# EAGLE schematic kegboard-mini (EAGLE 5.11)
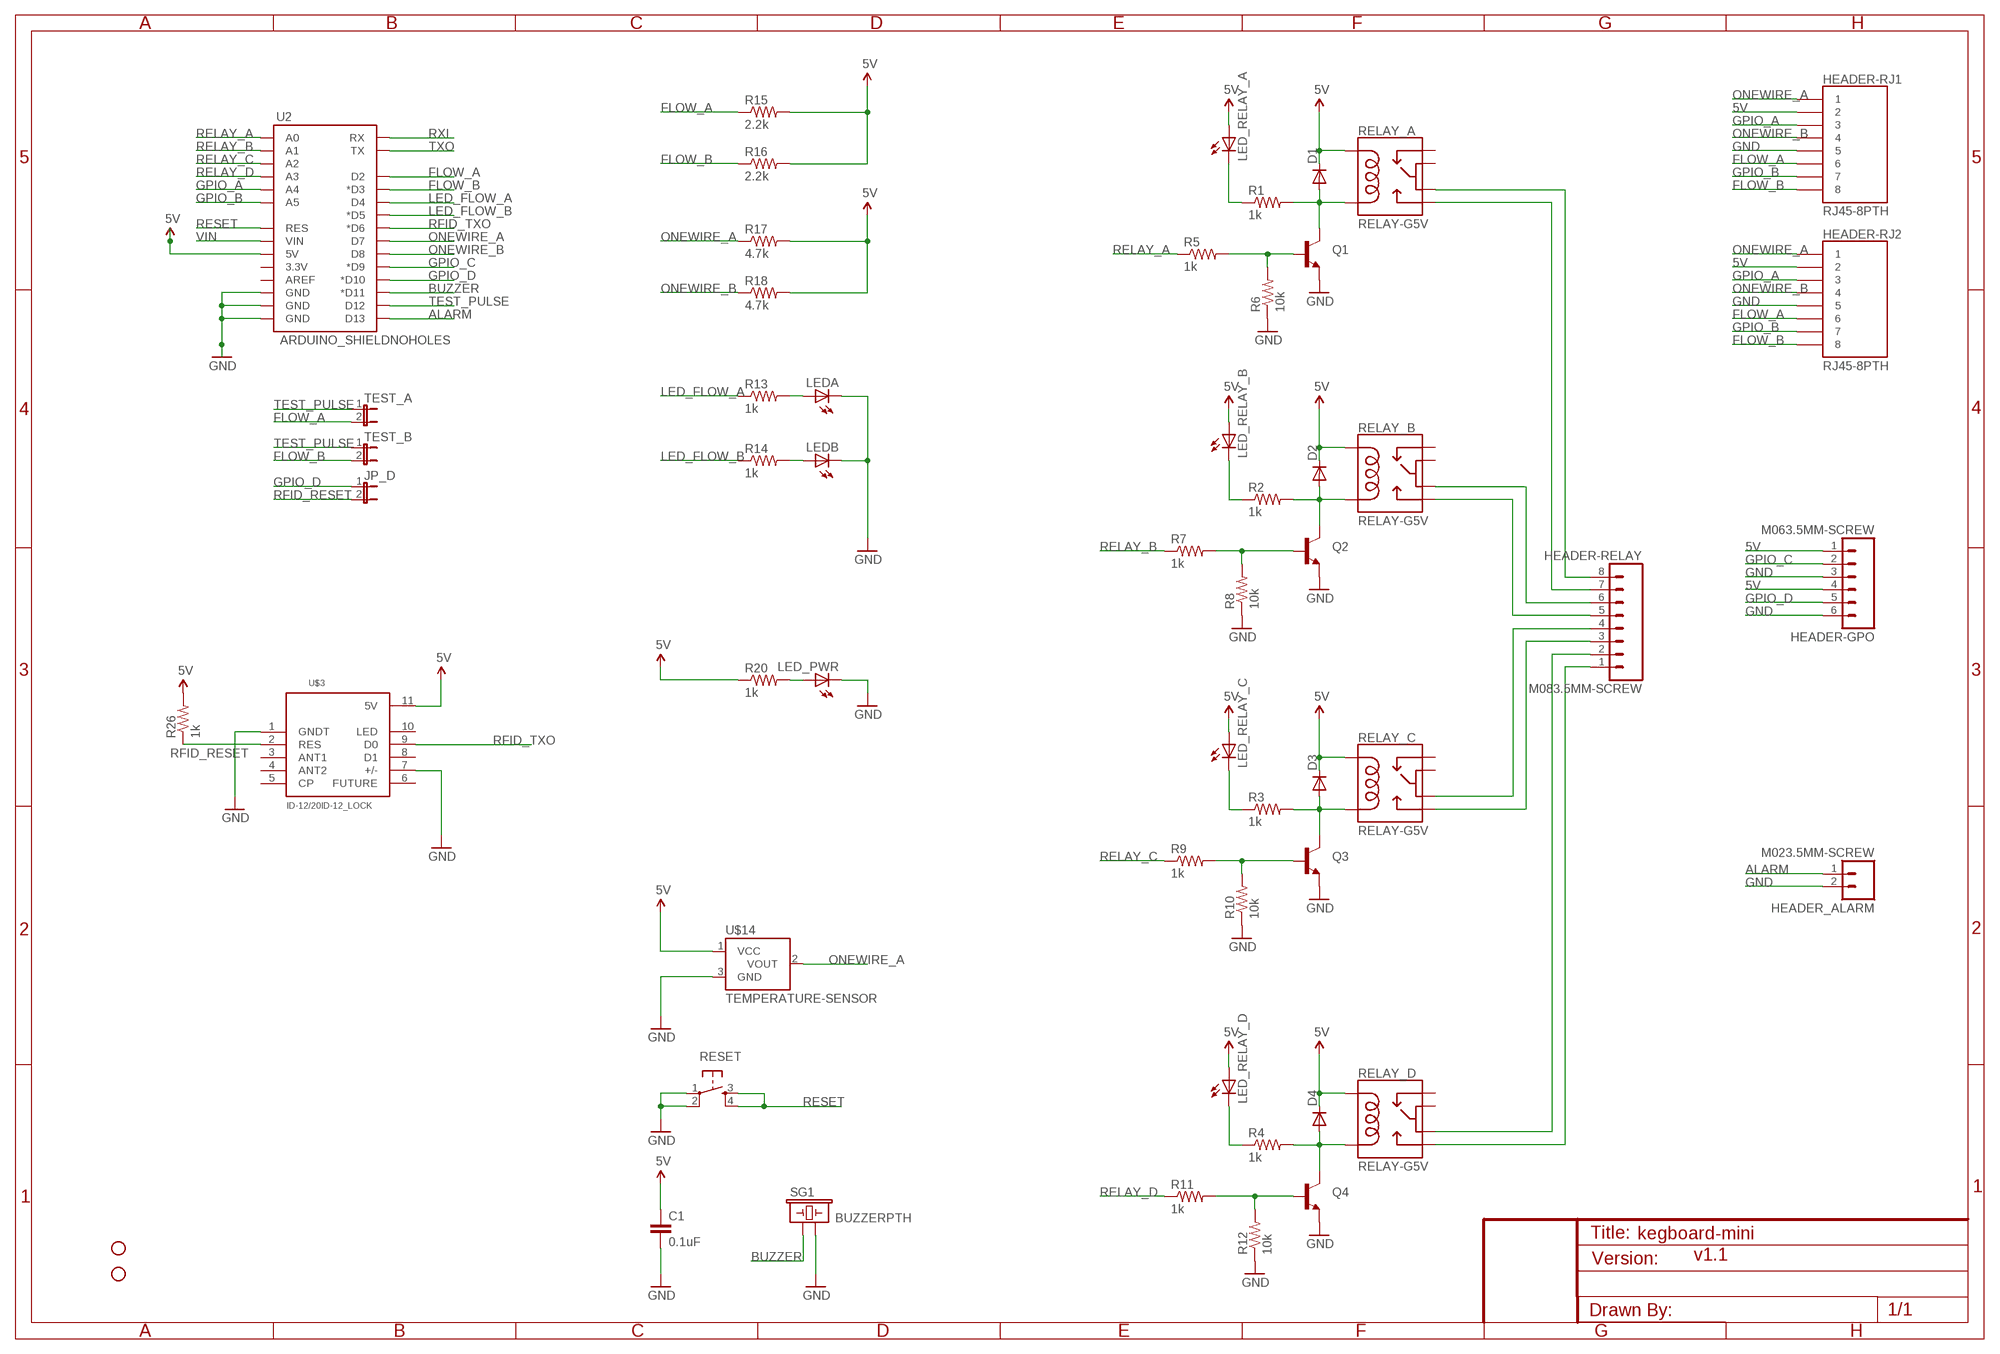
[diagram p0: schematic, sheet 1]

## Parts
C1  0.1uF  CAPPTH  [CAP-PTH-SMALL]
D1  DIODE1N4148  [DIODE-1N4148]
D2  DIODE1N4148  [DIODE-1N4148]
D3  DIODE1N4148  [DIODE-1N4148]
D4  DIODE1N4148  [DIODE-1N4148]
HEADER-GPO  M063.5MM-SCREW  M063.5MM-6  [SCREWTERMINAL-3.5MM-6]
HEADER-RELAY  M083.5MM-SCREW  M083.5MM-8  [SCREWTERMINAL-3.5MM-8]
HEADER-RJ1  RJ45-8PTH  [RJ45-8]
HEADER-RJ2  RJ45-8PTH  [RJ45-8]
HEADER_ALARM  M023.5MM-SCREW  M023.5MM  [SCREWTERMINAL-3.5MM-2]
JP3  STAND-OFF  [STAND-OFF]
JP5  STAND-OFF  [STAND-OFF]
JP_D  JUMPER-2PTH  [1X02]
LED_PWR  LED3MM  [LED3MM]
LED_RELAY_A  LED3MM  [LED3MM]
LED_RELAY_B  LED3MM  [LED3MM]
LED_RELAY_C  LED3MM  [LED3MM]
LED_RELAY_D  LED3MM  [LED3MM]
LEDA  LED3MM  [LED3MM]
LEDB  LED3MM  [LED3MM]
Q1  TRANSISTOR_NPNTO92  [TO-92]
Q2  TRANSISTOR_NPNTO92  [TO-92]
Q3  TRANSISTOR_NPNTO92  [TO-92]
Q4  TRANSISTOR_NPNTO92  [TO-92]
R1  1k  RESISTORPTH1  [AXIAL-0.3]
R2  1k  RESISTORPTH1  [AXIAL-0.3]
R3  1k  RESISTORPTH1  [AXIAL-0.3]
R4  1k  RESISTORPTH1  [AXIAL-0.3]
R5  1k  RESISTORPTH1  [AXIAL-0.3]
R6  10k  RESISTORPTH1  [AXIAL-0.3]
R7  1k  RESISTORPTH1  [AXIAL-0.3]
R8  10k  RESISTORPTH1  [AXIAL-0.3]
R9  1k  RESISTORPTH1  [AXIAL-0.3]
R10  10k  RESISTORPTH1  [AXIAL-0.3]
R11  1k  RESISTORPTH1  [AXIAL-0.3]
R12  10k  RESISTORPTH1  [AXIAL-0.3]
R13  1k  RESISTORPTH1  [AXIAL-0.3]
R14  1k  RESISTORPTH1  [AXIAL-0.3]
R15  2.2k  RESISTORPTH1  [AXIAL-0.3]
R16  2.2k  RESISTORPTH1  [AXIAL-0.3]
R17  4.7k  RESISTORPTH1  [AXIAL-0.3]
R18  4.7k  RESISTORPTH1  [AXIAL-0.3]
R20  1k  RESISTORPTH1  [AXIAL-0.3]
R26  1k  RESISTORPTH1  [AXIAL-0.3]
RELAY_A  RELAY-G5V  RELAY-2G5Q  [RELAY-G5V]
RELAY_B  RELAY-G5V  RELAY-2G5Q  [RELAY-G5V]
RELAY_C  RELAY-G5V  RELAY-2G5Q  [RELAY-G5V]
RELAY_D  RELAY-G5V  RELAY-2G5Q  [RELAY-G5V]
RESET  TAC_SWITCHPTH  [TACTILE-PTH]
SG1  BUZZERPTH  [BUZZER-12MM]
TEST_A  JUMPER-2PTH  [1X02]
TEST_B  JUMPER-2PTH  [1X02]
U2  ARDUINO_SHIELDNOHOLES  [DUEMILANOVE_SHIELD_NOHOLES]
U$3  ID-12/20ID-12_LOCK  [ID-12_LOCK]
U$14  TEMPERATURE-SENSOR  [TO-92]

## Nets
5V: C1.1 D1.C D2.C D3.C D4.C HEADER-GPO.1 HEADER-GPO.4 HEADER-RJ1.2 HEADER-RJ2.2 LED_RELAY_A.A LED_RELAY_B.A LED_RELAY_C.A LED_RELAY_D.A R15.P$2 R16.P$2 R17.P$2 R18.P$2 R20.P$1 R26.P$2 RELAY_A.2 RELAY_B.2 RELAY_C.2 RELAY_D.2 U2.5V U$3.11(5V) U$14.1(VCC)
ALARM: HEADER_ALARM.1 U2.D13
BUZZER: SG1.+ U2.D11(*D11)
FLOW_A: HEADER-RJ1.6 HEADER-RJ2.6 R15.P$1 TEST_A.2 U2.D2
FLOW_B: HEADER-RJ1.8 HEADER-RJ2.8 R16.P$1 TEST_B.2 U2.D3(*D3)
GND: C1.2 HEADER-GPO.3 HEADER-GPO.6 HEADER-RJ1.5 HEADER-RJ2.5 HEADER_ALARM.2 LED_PWR.K(C) LEDA.K(C) LEDB.K(C) Q1.1(E) Q2.1(E) Q3.1(E) Q4.1(E) R6.P$1 R8.P$1 R10.P$1 R12.P$1 RESET.1 RESET.2 SG1.- U2.GND@0(GND) U2.GND@1(GND) U2.GND@2(GND) U$3.1(GNDT) U$3.7(+/-) U$14.3(GND)
GPIO_A: HEADER-RJ1.3 HEADER-RJ2.3 U2.A4
GPIO_B: HEADER-RJ1.7 HEADER-RJ2.7 U2.A5
GPIO_C: HEADER-GPO.2 U2.D9(*D9)
GPIO_D: HEADER-GPO.5 JP_D.1 U2.D10(*D10)
LED_FLOW_A: R13.P$1 U2.D4
LED_FLOW_B: R14.P$1 U2.D5(*D5)
LED_RELAY_D: LED_RELAY_D.K(C) R4.P$1
N$1: LED_RELAY_A.K(C) R1.P$1
N$2: Q2.2(B) R7.P$2 R8.P$2
N$3: Q1.2(B) R5.P$2 R6.P$2
N$4: Q3.2(B) R9.P$2 R10.P$2
N$5: LED_RELAY_C.K(C) R3.P$1
N$6: Q4.2(B) R11.P$2 R12.P$2
N$7: LED_RELAY_B.K(C) R2.P$1
N$8: LEDB.A R14.P$2
N$9: LEDA.A R13.P$2
N$10: D1.A Q1.3(C) R1.P$2 RELAY_A.9
N$12: D2.A Q2.3(C) R2.P$2 RELAY_B.9
N$13: LED_PWR.A R20.P$2
N$14: D3.A Q3.3(C) R3.P$2 RELAY_C.9
N$15: HEADER-RELAY.8 RELAY_A.6
N$16: D4.A Q4.3(C) R4.P$2 RELAY_D.9
N$20: HEADER-RELAY.7 RELAY_A.10
N$21: HEADER-RELAY.6 RELAY_B.6
N$22: HEADER-RELAY.5 RELAY_B.10
N$23: HEADER-RELAY.4 RELAY_C.6
N$25: HEADER-RELAY.3 RELAY_C.10
N$26: HEADER-RELAY.2 RELAY_D.6
N$27: HEADER-RELAY.1 RELAY_D.10
ONEWIRE_A: HEADER-RJ1.1 HEADER-RJ2.1 R17.P$1 U2.D7 U$14.2(VOUT)
ONEWIRE_B: HEADER-RJ1.4 HEADER-RJ2.4 R18.P$1 U2.D8
RELAY_A: R5.P$1 U2.A0
RELAY_B: R7.P$1 U2.A1
RELAY_C: R9.P$1 U2.A2
RELAY_D: R11.P$1 U2.A3
RESET: RESET.3 RESET.4 U2.RES
RFID_RESET: JP_D.2 R26.P$1 U$3.2(RES)
RFID_TXO: U2.D6(*D6) U$3.9(D0)
RXI: U2.RX
TEST_PULSE: TEST_A.1 TEST_B.1 U2.D12
TXO: U2.TX
VIN: U2.VIN
Unconnected: RELAY_A.1 RELAY_A.5 RELAY_B.1 RELAY_B.5 RELAY_C.1 RELAY_C.5 RELAY_D.1 RELAY_D.5 U2.3.3V U2.AREF U$3.3(ANT1) U$3.4(ANT2) U$3.5(CP) U$3.6(FUTURE) U$3.8(D1) U$3.10(LED)

## Notes on the sheet
- v1.1

## Library data of the parts
C1 = SparkFun:CAP: Capacitor Standard 0603 ceramic capacitor, and 0.1" leaded capacitor.
D1-D4 = SparkFun:DIODE: Diode These are standard reverse protection diodes and small signal diodes. SMA package can handle up to about 1A. SOD-323 can handle about 200mA. What the SOD-323 package when ordering, there are some mfgs out there that are 5-pin packages.
HEADER-GPO = SparkFun:M06: Header 6 Standard 6-pin 0.1" header. Use with straight break away headers (SKU : PRT-00116), right angle break away headers (PRT-00553), swiss pins (PRT-00743), machine pins (PRT-00117), and female headers (PRT-00115). Molex polarized connector foot print use with SKU : PRT-08094 with associated crimp pins and housings. NOTES ON THE VARIANTS LOCK and LOCK_LONGPADS... This footprint was designed to help hold the alignment of a through-hole component (i.e. 6-pin header) while soldering it into place. You may notice that each hole has been shifted either up or down by 0.005 of an inch from it's more standard position (which is a perfectly straight line). This slight alteration caused the pins (the squares in the middle) to touch the edges of the holes. Because they are alternating, it causes a "brace" to hold the component in place. 0.005 has proven to be the perfect amount of "off-center" position when using our standard breakaway headers. Although looks a little odd when you look at the bare footprint, once you have a header in there, the alteration is very hard to notice. Also, if you push a header all the way into place, it is covered up entirely on the bottom side. This idea of altering the position of holes to aid alignment will be further integrated into the Sparkfun Library for other footprints. It can help hold any component with 3 or more connection pins.
HEADER-RELAY = SparkFun:M08: Header 8 Standard 8-pin 0.1" header. Use with straight break away headers (SKU : PRT-00116), right angle break away headers (PRT-00553), swiss pins (PRT-00743), machine pins (PRT-00117), and female headers (PRT-00115).
HEADER-RJ1 HEADER-RJ2 = SparkFun:RJ45-8: RJ45 Jack Simple RJ45, 8-pin connection - connector for common Cat5, Cat5e, and Cat6 Ethernet cables. Footprint not yet proven in production. Connector sku is PRT-00643; Breakout PCB sku is BOB-00716.
HEADER_ALARM = SparkFun:M02: Header 2 Standard 2-pin 0.1" header. Use with straight break away headers (SKU : PRT-00116), right angle break away headers (PRT-00553), swiss pins (PRT-00743), machine pins (PRT-00117), and female headers (PRT-00115). Molex polarized connector foot print use with SKU : PRT-08233 with associated crimp pins and housings.
JP3 JP5 = SparkFun:STAND-OFF: Stand Off This is the mechanical footprint for a #4 phillips button head screw. Use the keepout ring to avoid running the screw head into surrounding components. SKU : PRT-00447
JP_D TEST_A TEST_B = SparkFun-20100412:JUMPER-2: Jumper Basic 0.1" spaced jumper. Use with breakaway headers.
LED_PWR LED_RELAY_A LED_RELAY_B LED_RELAY_C LED_RELAY_D LEDA LEDB = SparkFun:LED: LEDs Standard schematic elements and footprints for 5mm, 3mm, 1206, and 0603 sized LEDs. 5mm - Spark Fun Electronics SKU : COM-00529 (and others)
Q1-Q4 = SparkFun:TRANSISTOR_NPN: Transistor NPN BJT configuration in SOT23 package. MMBT2222 is the common NPN we use. Double check BCE configuration again layout.
R1-R18 R20 R26 = SparkFun:RESISTOR: Resistor Basic schematic elements and footprints for 0603, 1206, and PTH 1/10th watt (small) resistors.
RELAY_A RELAY_B RELAY_C RELAY_D = SparkFun:RELAY-2
RESET = SparkFun:TAC_SWITCH: Momentary Switch Button commonly used for reset or general input. Spark Fun Electronics SKU : COM-00097
SG1 = SparkFun:BUZZER: Buzzer 12mm Spark Fun Electronics SKU : Comp-Buzzer
U2 = SparkFun:ARDUINO_SHIELD
U$3 = SparkFun-20100412:ID-12/20: ID2, ID12, and ID20 Package
U$14 = SparkFun:TEMPERATURE-SENSOR